# EAGLE design HID2AMI.Deluxe.Rev1.1.0.redist (EAGLE 9.2.0)
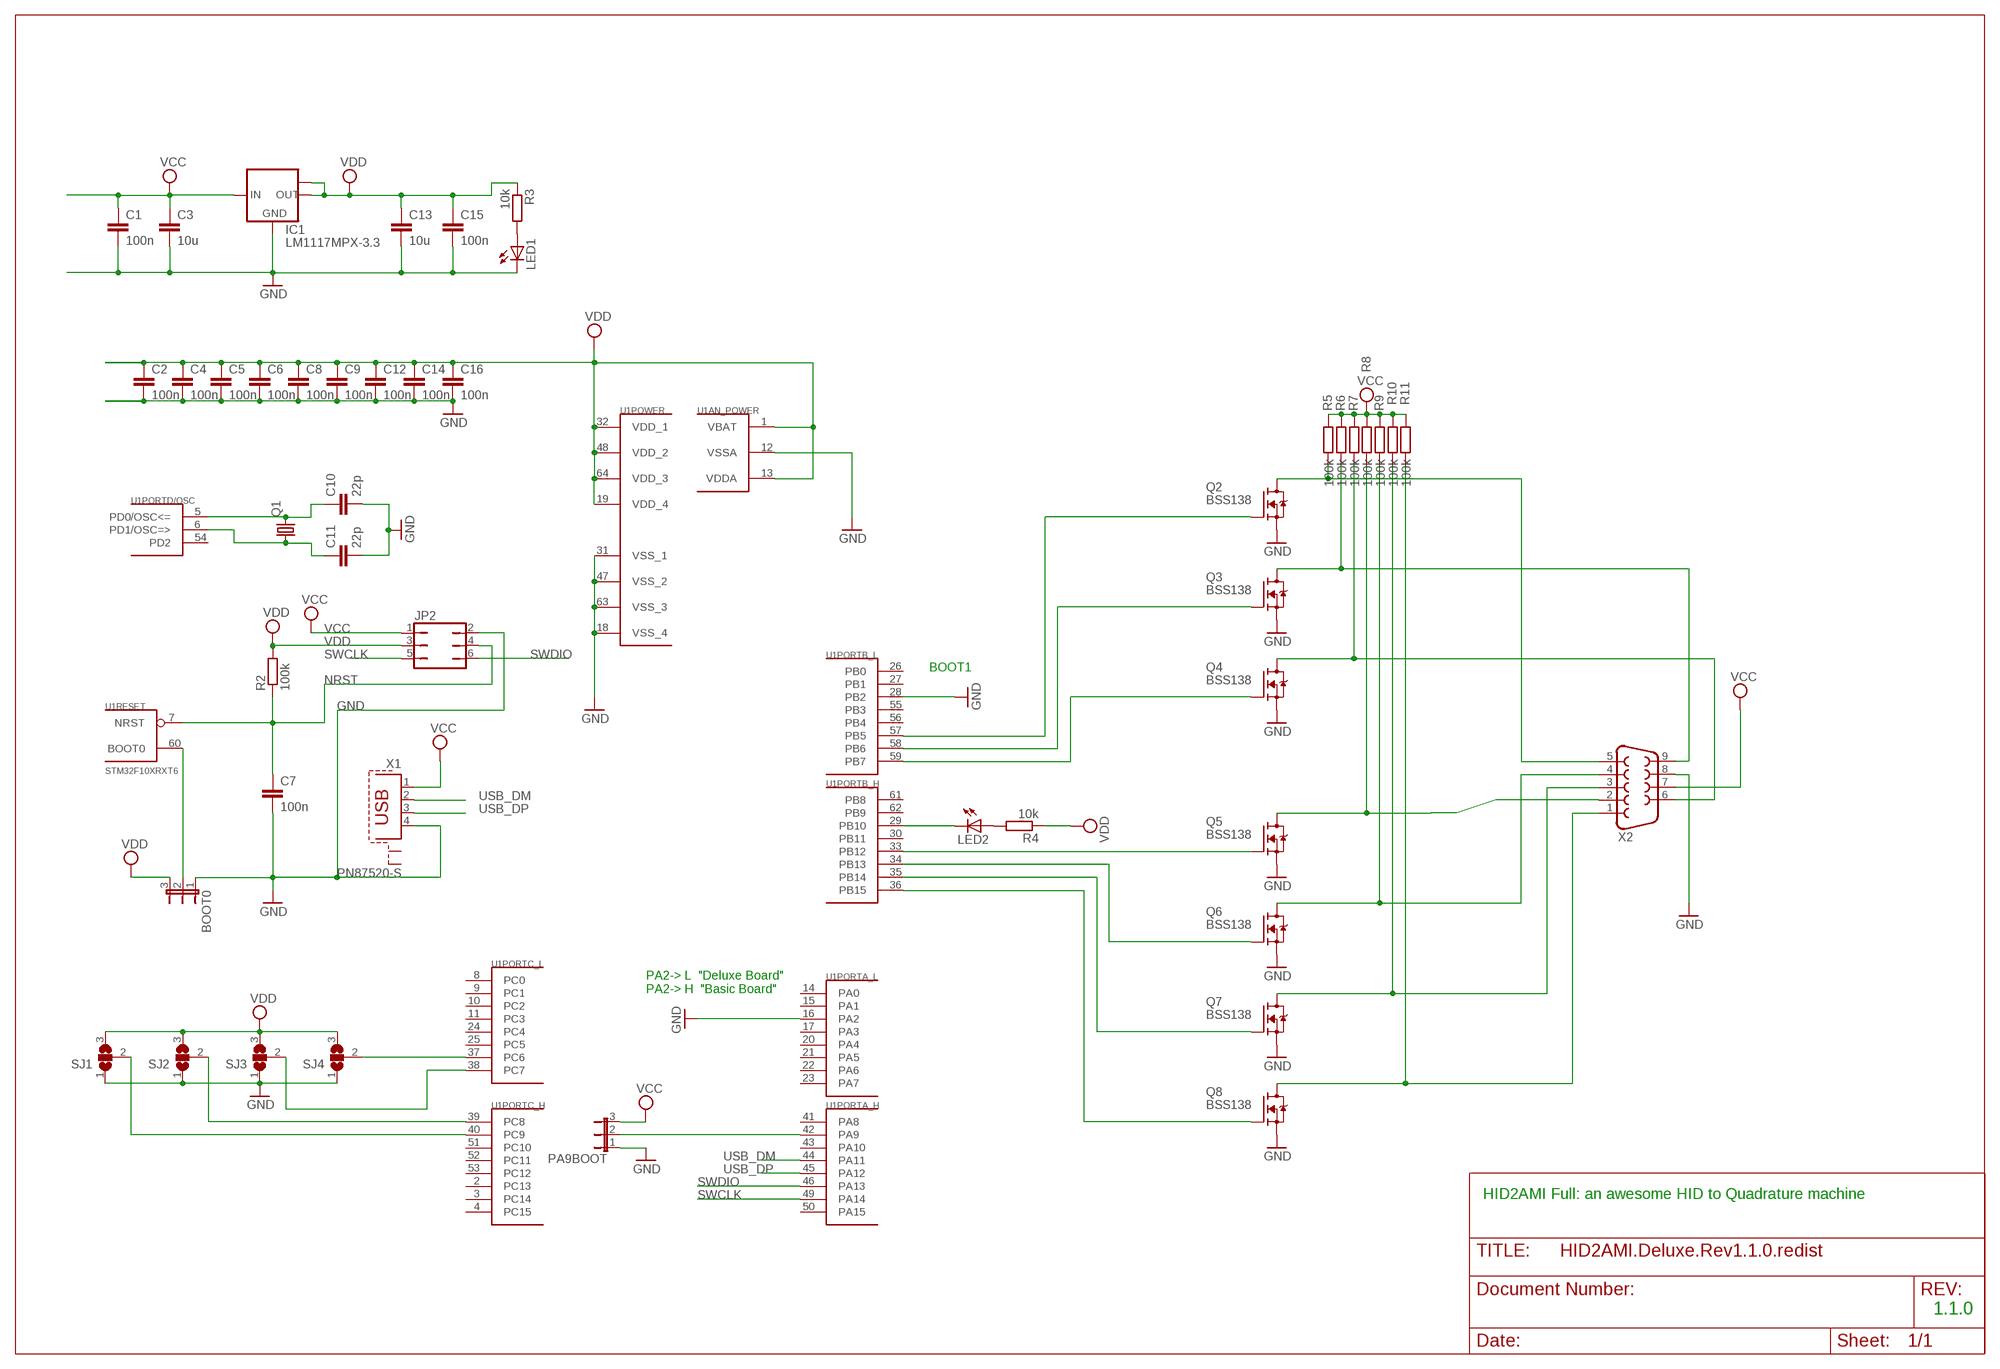
[diagram p0: schematic, sheet 1]

## Parts
BOOT0  JP2E  [JP2]
C1  100n  C-EUC0805  [C0805]
C2  100n  C-EUC0805  [C0805]
C3  10u  C-EUC1206  [C1206]
C4  100n  C-EUC0805  [C0805]
C5  100n  C-EUC0805  [C0805]
C6  100n  C-EUC0805  [C0805]
C7  100n  C-EUC0805  [C0805]
C8  100n  C-EUC0805  [C0805]
C9  100n  C-EUC0805  [C0805]
C10  22p  C-EUC0805  [C0805]
C11  22p  C-EUC0805  [C0805]
C12  100n  C-EUC0805  [C0805]
C13  10u  C-EUC0805  [C0805]
C14  100n  C-EUC0805  [C0805]
C15  100n  C-EUC0805  [C0805]
C16  100n  C-EUC0805  [C0805]
IC1  LM1117MPX-3.3  [SOT223]
JP2  JP3Q  [JP3Q]
LED1  LEDSML0805  [SML0805]
LED2  LEDSML0805  [SML0805]
PA9BOOT  JP2E  [JP2]
Q1  CRYSTALHC49S  [HC49/S]
Q2  BSS138  [SOT23]
Q3  BSS138  [SOT23]
Q4  BSS138  [SOT23]
Q5  BSS138  [SOT23]
Q6  BSS138  [SOT23]
Q7  BSS138  [SOT23]
Q8  BSS138  [SOT23]
R2  100k  R-EU_M0805  [M0805]
R3  10k  R-EU_M0805  [M0805]
R4  10k  R-EU_M0805  [M0805]
R5  100k  R-EU_M0805  [M0805]
R6  100k  R-EU_M0805  [M0805]
R7  100k  R-EU_M0805  [M0805]
R8  100k  R-EU_M0805  [M0805]
R9  100k  R-EU_M0805  [M0805]
R10  100k  R-EU_M0805  [M0805]
R11  100k  R-EU_M0805  [M0805]
SJ1  SJ2W  [SJ_2]
SJ2  SJ2W  [SJ_2]
SJ3  SJ2W  [SJ_2]
SJ4  SJ2W  [SJ_2]
U1  STM32F10XRXT6  [TQFP64]
X1  PN87520-S  [PN87520-S]
X2  F09HP  [F09HP]

## Nets
GND: BOOT0.1 C1.2 C2.2 C3.2 C4.2 C5.2 C6.2 C7.2 C8.2 C9.2 C10.2 C11.2 C12.2 C13.2 C14.2 C15.2 C16.2 IC1.1(GND) JP2.2 LED1.C PA9BOOT.1 Q2.2(S) Q3.2(S) Q4.2(S) Q5.2(S) Q6.2(S) Q7.2(S) Q8.2(S) SJ1.1 SJ2.1 SJ3.1 SJ4.1 U1.12(AN_POWER:VSSA) U1.16(PORTA_L:PA2) U1.18(POWER:VSS_4) U1.28(PORTB_L:PB2) U1.31(POWER:VSS_1) U1.47(POWER:VSS_2) U1.63(POWER:VSS_3) X1.4 X2.8
N$1: C10.1 Q1.2 U1.5(PORTD/OSC:PD0/OSC<=)
N$2: C11.1 Q1.1 U1.6(PORTD/OSC:PD1/OSC=>)
N$3: BOOT0.2 U1.60(RESET:BOOT0)
N$5: PA9BOOT.2 U1.42(PORTA_H:PA9)
N$6: SJ1.2 U1.40(PORTC_H:PC9)
N$7: LED2.A R4.2
N$8: LED2.C U1.29(PORTB_H:PB10)
N$9: SJ4.2 U1.37(PORTC_L:PC6)
N$10: SJ3.2 U1.38(PORTC_L:PC7)
N$11: SJ2.2 U1.39(PORTC_H:PC8)
N$12: LED1.A R3.2
N$13: Q2.1(G) U1.57(PORTB_L:PB5)
N$14: Q3.1(G) U1.58(PORTB_L:PB6)
N$15: Q4.1(G) U1.59(PORTB_L:PB7)
N$16: Q5.1(G) U1.33(PORTB_H:PB12)
N$17: Q6.1(G) U1.34(PORTB_H:PB13)
N$18: Q7.1(G) U1.35(PORTB_H:PB14)
N$19: Q8.1(G) U1.36(PORTB_H:PB15)
N$34: Q2.3(D) R5.2 X2.5
N$35: Q3.3(D) R6.2 X2.9
N$36: Q4.3(D) R7.2 X2.6
N$37: Q5.3(D) R8.2 X2.2
N$38: Q6.3(D) R9.2 X2.4
N$39: Q7.3(D) R10.2 X2.3
N$40: Q8.3(D) R11.2 X2.1
NRST: C7.1 JP2.4 R2.1 U1.7(RESET:NRST)
SWCLK: JP2.5 U1.49(PORTA_H:PA14)
SWDIO: JP2.6 U1.46(PORTA_H:PA13)
USB_DM: U1.44(PORTA_H:PA11) X1.2
USB_DP: U1.45(PORTA_H:PA12) X1.3
VCC: C1.1 C3.1 IC1.3(IN) JP2.1 PA9BOOT.3 R5.1 R6.1 R7.1 R8.1 R9.1 R10.1 R11.1 X1.1 X2.7
VDD: BOOT0.3 C2.1 C4.1 C5.1 C6.1 C8.1 C9.1 C12.1 C13.1 C14.1 C15.1 C16.1 IC1.2(OUT) IC1.TAB(OUT1) JP2.3 R2.2 R3.1 R4.1 SJ1.3 SJ2.3 SJ3.3 SJ4.3 U1.1(AN_POWER:VBAT) U1.13(AN_POWER:VDDA) U1.19(POWER:VDD_4) U1.32(POWER:VDD_1) U1.48(POWER:VDD_2) U1.64(POWER:VDD_3)
Unconnected: U1.2(PORTC_H:PC13) U1.3(PORTC_H:PC14) U1.4(PORTC_H:PC15) U1.8(PORTC_L:PC0) U1.9(PORTC_L:PC1) U1.10(PORTC_L:PC2) U1.11(PORTC_L:PC3) U1.14(PORTA_L:PA0) U1.15(PORTA_L:PA1) U1.17(PORTA_L:PA3) U1.20(PORTA_L:PA4) U1.21(PORTA_L:PA5) U1.22(PORTA_L:PA6) U1.23(PORTA_L:PA7) U1.24(PORTC_L:PC4) U1.25(PORTC_L:PC5) U1.26(PORTB_L:PB0) U1.27(PORTB_L:PB1) U1.30(PORTB_H:PB11) U1.41(PORTA_H:PA8) U1.43(PORTA_H:PA10) U1.50(PORTA_H:PA15) U1.51(PORTC_H:PC10) U1.52(PORTC_H:PC11) U1.53(PORTC_H:PC12) U1.54(PORTD/OSC:PD2) U1.55(PORTB_L:PB3) U1.56(PORTB_L:PB4) U1.61(PORTB_H:PB8) U1.62(PORTB_H:PB9) X1.S1 X1.S2

## Notes on the sheet
- BOOT1
- PA2-> L  "Deluxe Board"
  PA2-> H  "Basic Board"
- HID2AMI Full: an awesome HID to Quadrature machine
- 1.1.0

## Library data of the parts
BOOT0 PA9BOOT = jumper:JP2E: JUMPER
C1-C16 = rcl:C-EU: CAPACITOR, European symbol; SPICEPREFIX: C
IC1 = lm1117:LM1117MPX-*
JP2 = jumper:JP3Q: JUMPER
LED1 LED2 = led:LED: LED OSRAM: - CHIPLED LG R971, LG N971, LY N971, LG Q971, LY Q971, LO R971, LY R971 LH N974, LH R974 LS Q976, LO Q976, LY Q976 LO Q996 - Hyper CHIPLED LW Q18S LB Q993, LB Q99A, LB R99A - SideLED LS A670, LO A670, LY A670, LG A670, LP A670 LB A673, LV A673, LT A673, LW A673 LH A674 LY A675 LS A676, LA A676, LO A676, LY A676, LW A676 LS A679, LY A679, LG A679 - Hyper Micro SIDELED® LS Y876, LA Y876, LO Y876, LY Y876 LT Y87S - SmartLED LW L88C, LW L88S LB L89C, LB L89S, LG L890 LS L89K, LO L89K, LY L89K LS L896, LA L896, LO L896, LY L896 - TOPLED LS T670, LO T670, LY T670, LG T670, LP T670 LSG T670, LSP T670, LSY T670, LOP T670, LYG T670 LG T671, LOG T671, LSG T671 LB T673, LV T673, LT T673, LW T673 LH T674 LS T676, LA T676, LO T676, LY T676, LB T676, LH T676, LSB T676, LW T676 LB T67C, LV T67C, LT T67C, LS T67K, LO T67K, LY T67K, LW E67C LS E67B, LA E67B, LO E67B, LY E67B, LB E67C, LV E67C, LT E67C LW T67C LS T679, LY T679, LG T679 LS T770, LO T770, LY T770, LG T770, LP T770 LB T773, LV T773, LT T773, LW T773 LH T774 LS E675, LA E675, LY E675, LS T675 LS T776, LA T776, LO T776, LY T776, LB T776 LHGB T686 LT T68C, LB T68C - Hyper Mini TOPLED® LB M676 - Mini TOPLED Santana® LG M470 LS M47K, LO M47K, LY M47K Source: http://www.osram.convergy.de LUXEON: - LUMILED® LXK2-PW12-R00, LXK2-PW12-S00, LXK2-PW14-U00, LXK2-PW14-V00 LXK2-PM12-R00, LXK2-PM12-S00, LXK2-PM14-U00 LXK2-PE12-Q00, LXK2-PE12-R00, LXK2-PE12-S00, LXK2-PE14-T00, LXK2-PE14-U00 LXK2-PB12-K00, LXK2-PB12-L00, LXK2-PB12-M00, LXK2-PB14-N00, LXK2-PB14-P00, LXK2-PB14-Q00 LXK2-PR12-L00, LXK2-PR12-M00, LXK2-PR14-Q00, LXK2-PR14-R00 LXK2-PD12-Q00, LXK2-PD12-R00, LXK2-PD12-S00 LXK2-PH12-R00, LXK2-PH12-S00 LXK2-PL12-P00, LXK2-PL12-Q00, LXK2-PL12-R00 Source: www.luxeon.com KINGBRIGHT: KA-3528ASYC Source: www.kingbright.com
Q1 = crystal:CRYSTAL: CRYSTAL; OC_FARNELL: 1667008; OC_NEWARK: unknown
Q2-Q8 = bss138_10:BSS138: BSS138 N-Channel Logic Level Enhancement Mode Field Effect Transistor Source: http://www.fairchildsemi.com/datasheets/BS/BSS138.pdf; MF: Fairchild; MPN: BSS138; OC_FARNELL: 9845330; OC_NEWARK: 67R2009
R2-R11 = rcl:R-EU_: RESISTOR, European symbol; SPICEPREFIX: R
SJ1-SJ4 = jumper:SJ2W: SMD solder JUMPER
U1 = stm32:STM32F10XRXT6: STM32F101/103 64pin LQFP
X1 = con-berg:PN87520-S; OC_FARNELL: unknown; OC_NEWARK: unknown
X2 = con-subd:F09: SUB-D; OC_FARNELL: unknown; OC_NEWARK: unknown

## Board
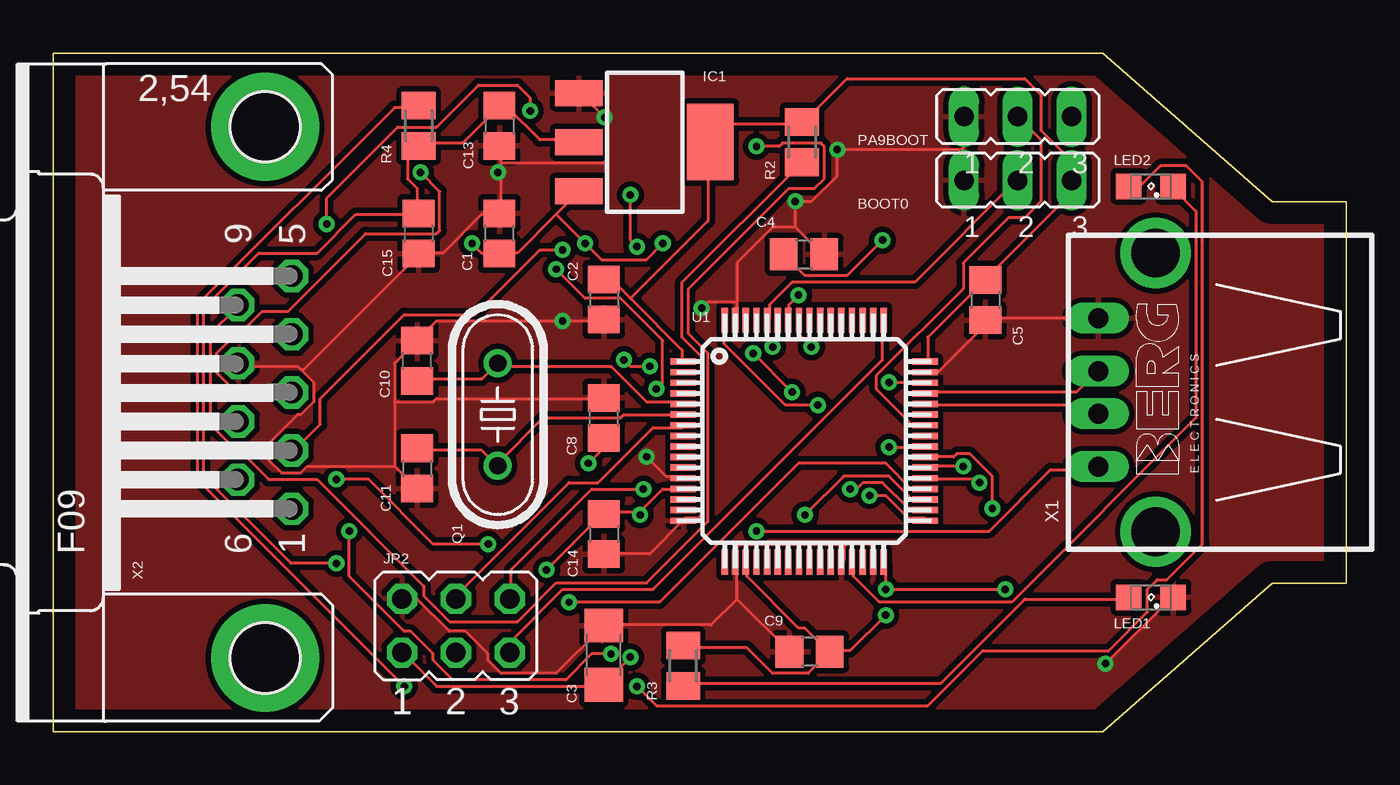
[diagram p1: board, top side]
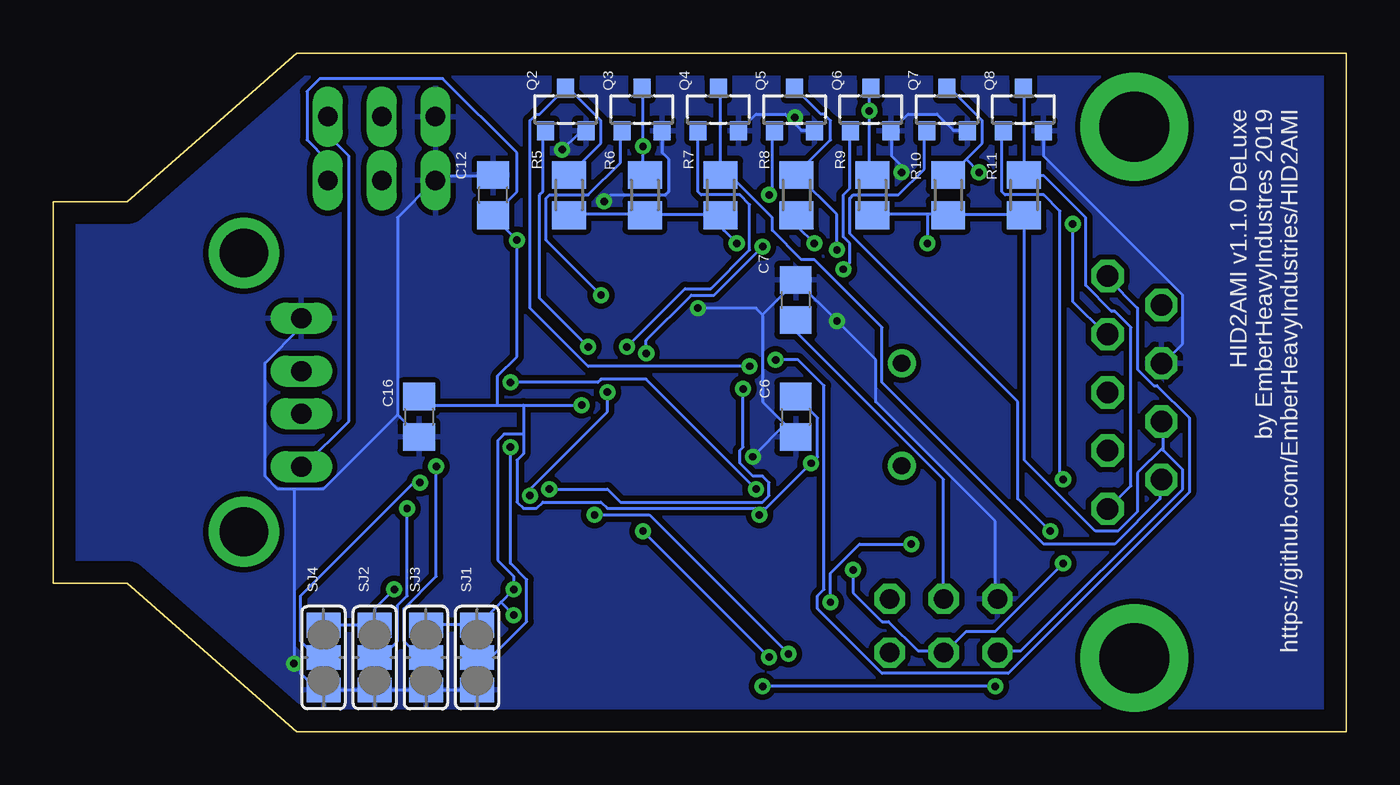
[diagram p2: board, bottom side, seen from below]

Size 61 x 32 mm. Coordinates in mm from the lower left corner, seen from the top.
Outline: 0,32 49.5,32 57.5,25 61,25 61,7 57.5,7 49.5,0 0,0 0,32
Copper layers (1*16): Top 0.035mm / dielectric 1.5mm / Bottom 0.035mm
Design rules "default": minimum track width 6mil, minimum drill 0.35mm, track to track 6mil, track to pad 6mil, pad to pad 6mil, via to via 6mil, smd to smd 6mil, copper to edge 40mil, drill to drill 6mil, minimum pad ring 10mil, minimum via ring 8mil, stop-mask expansion 4mil, vias tented up to drill 0mil, thermal gap 10mil

### Footprints (pad centres in the part's own frame; a part is rotated, then mirrored left to right if it is on the bottom)
JP2 = drill 0.914 long: 1 -2.54,0; 2 0,0; 3 2.54,0
C0805 = smd 1.3 x 1.5: 1 -0.95,0; 2 0.95,0
C1206 = smd 1.6 x 1.8: 1 -1.4,0; 2 1.4,0
SOT223 = smd 1.219 x 2.235: 1 -2.311,-3.099; 2 0,-3.099; 3 2.311,-3.099 | smd 3.6 x 2.2: TAB 0,3.099
JP3Q = drill 0.914 octagon: 1 -2.54,-1.27; 2 -2.54,1.27; 3 0,-1.27; 4 0,1.27; 5 2.54,-1.27; 6 2.54,1.27
SML0805 = smd 1.2 x 1.2: A 1.05,0; C -1.05,0
HC49/S = drill 0.813: 1 -2.413,0; 2 2.413,0
SOT23 = smd 0.8 x 0.9: 1 -0.95,-1; 2 0.95,-1; 3 0,1
M0805 = smd 1.3 x 1.6: 1 -0.95,0; 2 0.95,0
SJ_2 = smd 1.168 x 1.6: 1 -1.524,0; 2 0,0; 3 1.524,0
TQFP64 = smd 1.2 x 0.3: 1 -5.7,3.75; 2 -5.7,3.25; 3 -5.7,2.75; 4 -5.7,2.25; 5 -5.7,1.75; 6 -5.7,1.25; 7 -5.7,0.75; 8 -5.7,0.25; 9 -5.7,-0.25; 10 -5.7,-0.75; 11 -5.7,-1.25; 12 -5.7,-1.75; 13 -5.7,-2.25; 14 -5.7,-2.75; 15 -5.7,-3.25; 16 -5.7,-3.75; 33 5.7,-3.75; 34 5.7,-3.25; 35 5.7,-2.75; 36 5.7,-2.25; 37 5.7,-1.75; 38 5.7,-1.25; 39 5.7,-0.75; 40 5.7,-0.25; 41 5.7,0.25; 42 5.7,0.75; 43 5.7,1.25; 44 5.7,1.75; 45 5.7,2.25; 46 5.7,2.75; 47 5.7,3.25; 48 5.7,3.75 | smd 0.3 x 1.2: 17 -3.75,-5.7; 18 -3.25,-5.7; 19 -2.75,-5.7; 20 -2.25,-5.7; 21 -1.75,-5.7; 22 -1.25,-5.7; 23 -0.75,-5.7; 24 -0.25,-5.7; 25 0.25,-5.7; 26 0.75,-5.7; 27 1.25,-5.7; 28 1.75,-5.7; 29 2.25,-5.7; 30 2.75,-5.7; 31 3.25,-5.7; 32 3.75,-5.7; 49 3.75,5.7; 50 3.25,5.7; 51 2.75,5.7; 52 2.25,5.7; 53 1.75,5.7; 54 1.25,5.7; 55 0.75,5.7; 56 0.25,5.7; 57 -0.25,5.7; 58 -0.75,5.7; 59 -1.25,5.7; 60 -1.75,5.7; 61 -2.25,5.7; 62 -2.75,5.7; 63 -3.25,5.7; 64 -3.75,5.7
PN87520-S = drill 0.95 long: 1 -3.5,2.71; 2 -1,2.71; 3 1,2.71; 4 3.5,2.71 | drill 2.3 pad 2.9: S1 -6.57,0; S2 6.57,0
F09HP = drill 1.016 octagon: 1 -5.486,-1.27; 2 -2.743,-1.27; 3 0,-1.27; 4 2.743,-1.27; 5 5.486,-1.27; 6 -4.115,1.27; 7 -1.372,1.27; 8 1.372,1.27; 9 4.115,1.27 | drill 3.302 pad 5.08: G1 -12.522,0; G2 12.522,0

### Placement (x,y rotation side)
BOOT0  45.5,26 0 top
C1  21.05,23.49 90 top
C2  25.98,20.38 270 top
C3  25.98,3.61 90 top
C4  35.42,22.52 0 top
C5  43.97,20.36 270 top
C6  25.97,14.86 270 bottom
C7  25.97,20.36 90 bottom
C8  25.98,14.8 90 top
C9  35.68,3.77 180 top
C10  17.16,17.5 90 top
C11  17.16,12.42 270 top
C12  40.24,25.3 90 bottom
C13  21.05,28.57 270 top
C14  25.98,9.33 270 top
C15  17.24,23.49 270 top
C16  43.74,14.86 270 bottom
IC1  27.9,27.8 270 top
JP2  19,5 0 top
LED1  51.77,6.34 180 top
LED2  51.77,25.71 180 top
PA9BOOT  45.5,29 0 top
Q1  20.97,14.96 90 top
Q2  36.82,29.34 0 bottom
Q3  33.22,29.34 0 bottom
Q4  29.63,29.34 0 bottom
Q5  26.03,29.34 0 bottom
Q6  22.43,29.34 0 bottom
Q7  18.84,29.34 0 bottom
Q8  15.24,29.34 0 bottom
R2  35.33,27.8 90 top
R3  29.72,3.11 270 top
R4  17.24,28.57 90 top
R5  36.66,25.3 90 bottom
R6  33.09,25.3 90 bottom
R7  29.51,25.3 90 bottom
R8  25.94,25.3 90 bottom
R9  22.36,25.3 90 bottom
R10  18.79,25.3 90 bottom
R11  15.21,25.3 90 bottom
SJ1  41,3.5 90 bottom
SJ2  45.83,3.5 90 bottom
SJ3  43.41,3.5 90 bottom
SJ4  48.24,3.5 90 bottom
U1  35.43,13.7 0 top
X1  52,16 90 top
X2  10,16 90 top

### Tracks (layer width: path | path; a pad name or v marks a point on that pad's centre or on a via)
GND  (via drill 0.35)
  Top 0.152: v49.63,3.21 52.68,6.26 LED1.C | U1.47 41.25,16.93 41.71,16.93 43.84,19.06 43.84,19.37 C5.2 44,19.52 49.18,19.52 X1.4 | 35,23.79 v35,25.01 35.77,25.01 36.98,26.23 v36.98,27.44 42.93,27.44 | 35,23.79 36.22,22.57 C4.2 | 32.26,20.28 32.26,22.11 33.94,23.79 35,23.79 | 32.26,20.28 32.26,19.52 U1.63 | 42.93,27.44 42.93,26.07 BOOT0.1 | 42.93,27.44 42.93,28.97 PA9BOOT.1 | IC1.1 24.95,30.03 v26.01,28.97 26.01,28.66 26.16,28.51 26.16,26.99 26.01,26.84 21.14,26.84 | 21.14,26.38 21.14,24.55 C1.2 20.98,24.4 20.22,24.4 18.39,22.57 17.33,22.57 C15.2 17.17,22.41 11.84,17.08 11.69,17.08 | 21.14,26.38 21.14,26.84 | 21.14,26.84 21.14,27.6 C13.2 | 21.14,26.38 v20.98,26.38 | 16.11,12.51 17.02,11.59 C11.2 | 16.11,15.56 16.11,17.39 17.02,18.3 C10.2 17.17,18.45 18.09,19.37 v24.03,19.37 25.86,19.37 C2.2 | 16.11,15.56 16.11,12.51 | 16.11,15.56 17.94,15.56 18.09,15.71 25.86,15.71 C8.2 | 16.11,12.51 11.99,12.51 11.69,12.2 10.77,12.2 10.16,12.81 10.16,13.58 11.53,14.95 11.69,14.95 12.3,15.56 12.3,16.47 11.69,17.08 | 11.69,17.08 11.53,17.23 8.79,17.23 X2.8 | C14.2 26.01,8.39 28.15,8.39 29.67,9.92 U1.16 29.82,10.07 30.43,10.07 30.58,10.22 30.58,11.75 30.43,11.9 29.82,11.9 U1.12 29.67,12.05 28.91,12.05 v27.99,12.97 | 37.29,8.7 37.29,8.09 U1.28 | 37.29,8.7 37.44,8.85 38.51,8.85 38.66,8.7 38.66,8.09 U1.31 | 32.26,6.26 32.26,7.94 U1.18 32.26,8.09 32.26,8.7 32.41,8.85 36.98,8.85 37.14,8.7 37.29,8.7 | 32.26,6.26 34.7,3.82 C9.2 | 32.26,6.26 31.04,5.04 26.01,5.04 C3.2 25.86,4.89 23.73,2.76 21.14,2.76 20.53,3.36 20.53,3.67 19.46,4.74 18.7,4.74 17.17,6.26 16.56,6.26 JP2.2 | 32.26,20.28 30.89,20.28 v30.58,19.98
  Bottom 0.152: SJ1.1 41.1,1.99 43.39,1.99 SJ3.1 43.54,1.99 45.82,1.99 SJ2.1 45.98,1.99 48.11,1.99 SJ4.1 48.26,1.99 48.57,1.99 49.33,2.76 49.33,2.91 v49.63,3.21 49.63,11.44 | v35,25.01 34.7,25.31 32.11,25.31 31.96,25.46 31.96,26.99 32.26,27.29 32.26,28.21 Q3.2 | v36.98,27.44 36.22,28.21 35.92,28.21 Q2.2 | 44.76,14.95 43.84,14.03 C16.2 | 44.76,14.95 44.76,24.24 43.08,25.92 BOOT0.1 42.93,26.07 42.78,26.23 40.34,26.23 C12.2 | 49.63,11.44 48.26,11.44 44.76,14.95 | 49.63,11.44 50.4,11.44 51.01,12.05 51.01,17.39 49.33,19.06 49.33,19.37 X1.4 | 26.16,28.82 26.47,29.12 27.84,29.12 28.6,28.36 Q4.2 | 26.16,28.82 25.71,28.36 25.1,28.36 Q5.2 | v26.01,28.97 26.16,28.82 | Q7.2 17.94,28.36 18.55,28.36 19.31,29.12 20.68,29.12 21.44,28.36 Q6.2 21.44,28.21 21.44,27.14 20.98,26.68 v20.98,26.38 | Q8.2 14.28,28.21 14.28,27.14 7.72,20.59 7.72,18.3 8.64,17.39 X2.8 | 26.47,14.49 27.54,15.56 27.54,19.67 | 26.47,14.49 26.01,14.03 C6.2 26.47,14.49 | 27.54,19.67 26.01,21.2 C7.2 25.86,21.2 v24.03,19.37 22.2,17.54 22.2,15.56 16.56,9.92 16.56,6.41 JP2.2 | 26.47,14.49 v27.99,12.97 | v30.58,19.98 27.84,19.98 27.54,19.67
  pour Bottom (isolate 0.254): 0,32 49.5,32 57.5,25 61,25 61,7 57.5,7 49.5,0 0,0
  pour Top (isolate 0.254): 0,32 49.5,32 57.5,25 61,25 61,7 57.5,7 49.5,0 0,0
N$1
  Top 0.152: U1.5 29.67,15.56 27.99,15.56 26.32,17.23 20.98,17.23 Q1.2 20.83,17.23 20.22,16.62 17.17,16.62 C10.1
N$2
  Top 0.152: U1.6 29.67,14.95 26.93,14.95 26.77,14.8 23.12,14.8 20.98,12.66 Q1.1 20.83,12.66 20.22,13.27 17.17,13.27 C11.1
N$3
  Top 0.152: U1.60 33.78,19.52 33.78,20.13 34.85,21.2 40.64,21.2 45.37,25.92 BOOT0.2
N$5
  Top 0.152: U1.42 41.1,14.49 40.49,14.49 38.81,16.17 38.81,16.78 42.93,20.89 42.93,22.11 45.06,24.24 45.82,24.24 46.59,25.01 46.59,27.9 45.52,28.97 PA9BOOT.2
N$6  (via drill 0.35)
  Top 0.152: v39.42,13.42 41.1,13.42 U1.40
  Bottom 0.152: v39.42,13.42 39.42,7.94 38.66,7.18 38.66,5.19 40.34,3.52 40.95,3.52 SJ1.2
N$7  (via drill 0.35)
  Top 0.152: v27.54,2.15 28.45,1.23 41.25,1.23 43.84,3.82 49.79,3.82 51.62,5.65 51.62,6.72 52.07,7.18 52.53,7.18 54.21,8.85 54.21,25.92 53.44,26.68 52.23,26.68 51.31,25.77 50.85,25.77 LED2.A | v16.56,2.15 6.81,11.9 6.81,20.13 16.11,29.43 17.17,29.43 R4.2
  Bottom 0.152: v16.56,2.15 v27.54,2.15
N$8
  Top 0.152: U1.29 37.75,7.94 37.75,7.33 38.97,6.11 45.22,6.11 53.9,14.8 53.9,24.55 52.84,25.62 LED2.C
N$9  (via drill 0.35)
  Top 0.152: v43.69,11.75 43.54,11.9 41.25,11.9 U1.37
  Bottom 0.152: v43.69,11.75 44,11.75 49.33,6.41 49.33,4.28 48.57,3.52 48.26,3.52 SJ4.2
N$10  (via drill 0.35)
  Top 0.152: v42.93,12.51 41.25,12.51 U1.38
  Bottom 0.152: v42.93,12.51 42.93,7.33 44.45,5.8 44.45,4.28 43.54,3.36 SJ3.2
N$11  (via drill 0.35)
  Top 0.152: v44.3,10.53 44.3,12.05 43.23,13.12 42.62,13.12 42.47,12.97 41.25,12.97 U1.39
  Bottom 0.152: v44.3,10.53 44.3,6.41 44.76,5.96 44.76,4.28 45.52,3.52 45.82,3.52 SJ2.2
N$12
  Top 0.152: LED1.A 50.7,6.26 45.82,6.26 41.86,2.3 29.82,2.3 R3.2
N$13  (via drill 0.35)
  Top 0.152: v35.77,18.15 35.16,18.76 35.16,19.37 U1.57
  Bottom 0.152: v35.77,18.15 38.05,20.43 38.05,25.31 37.9,25.46 37.9,28.21 Q2.1
N$14  (via drill 0.35)
  Top 0.152: v35.16,20.59 34.7,20.13 34.7,19.52 U1.58
  Bottom 0.152: v35.16,20.59 37.75,23.18 37.75,25.16 37.59,25.31 35.77,25.31 34.24,26.84 34.24,28.21 Q3.1
N$15  (via drill 0.35)
  Top 0.152: v33.94,18.15 33.94,18.45 34.09,18.6 34.09,19.37 U1.59
  Bottom 0.152: v33.94,18.15 31.19,20.89 29.98,20.89 28.15,22.72 28.15,24.85 28.6,25.31 30.43,25.31 30.58,25.46 30.58,28.21 Q4.1
N$16  (via drill 0.35)
  Top 0.152: v27.23,25.31 27.23,23.18 v27.54,22.87 | v34.85,16.01 v33.02,17.84 | v38.51,11.14 39.27,11.14 40.34,10.07 41.1,10.07 U1.33
  Bottom 0.152: v27.23,25.31 27.08,25.46 27.08,28.21 Q5.1 | v27.54,22.87 29.82,20.59 30.89,20.59 33.02,18.45 v33.02,17.84 | v34.85,16.01 34.85,15.1 38.51,11.44 v38.51,11.14
N$17  (via drill 0.35)
  Top 0.152: v23.73,21.81 25.1,20.43 26.77,20.43 28.76,18.45 28.76,16.47 v28.45,16.17 | v37.59,11.44 37.9,11.44 38.2,11.75 39.12,11.75 40.34,10.53 41.1,10.53 U1.34
  Bottom 0.152: v23.73,21.81 23.42,22.11 23.42,23.02 23.73,23.33 23.73,25.31 23.42,25.62 23.42,28.21 Q6.1 | v28.45,16.17 28.45,13.42 28.6,13.27 28.6,12.66 27.99,12.05 27.54,12.05 27.23,11.75 27.23,11.14 27.54,10.83 34.24,10.83 34.85,11.44 v37.59,11.44
N$18  (via drill 0.35)
  Top 0.152: v13.97,9.46 13.97,7.33 16.56,4.74 16.87,4.74 17.94,3.67 17.94,3.36 18.85,2.45 24.18,2.45 25.4,3.67 v26.32,3.67 | v35.46,10.22 37.29,12.05 39.42,12.05 40.49,10.98 41.1,10.98 U1.35
  Bottom 0.152: v13.97,9.46 15.5,10.98 15.5,15.56 23.42,23.48 23.42,25.16 23.27,25.31 21.14,25.31 19.92,26.53 19.92,28.21 Q7.1 | v26.32,3.67 32.87,10.22 v35.46,10.22
N$19  (via drill 0.35)
  Top 0.152: v13.36,11.9 14.89,11.9 17.94,8.85 v20.53,8.85 | v24.34,6.11 28.6,6.11 35.16,12.66 39.27,12.66 40.49,11.44 41.1,11.44 U1.36
  Bottom 0.152: v13.36,11.9 13.52,12.05 13.52,24.55 14.28,25.31 16.11,25.31 16.26,25.46 16.26,28.21 Q8.1 | v20.53,8.85 22.96,8.85 24.34,7.48 v24.34,6.11
N$34  (via drill 0.35)
  Top 0.152: v28.15,17.23 27.23,17.23 v26.93,17.54
  Bottom 0.152: R5.2 36.53,26.38 35.16,27.75 35.16,28.82 36.68,30.34 Q2.3 36.83,30.34 38.05,29.12 38.2,29.12 38.51,28.82 38.51,19.98 35.77,17.23 v28.15,17.23 | v26.93,17.54 25.86,17.54 24.64,16.32 24.64,6.72 24.95,6.41 24.95,5.8 21.9,2.76 15.95,2.76 7.42,11.29 7.42,14.8 8.94,16.32 9.1,16.32 9.86,17.08 9.86,19.98 11.23,21.35 X2.5
N$35  (via drill 0.35)
  Top 0.152: v33.17,27.6 34.24,27.6 34.39,27.75 36.22,27.75 36.38,27.6 36.38,26.07 35.92,25.62 34.7,25.62 29.98,20.89 29.98,18.76 30.89,17.84 30.89,9.92 27.99,7.02 23.73,7.02 21.9,5.19 18.7,5.19 17.48,6.41 17.48,6.87 12.45,11.9 10.16,11.9 8.49,13.58 8.33,13.58 7.42,14.49 7.42,18.76 8.64,19.98 X2.9
  Bottom 0.152: Q3.3 33.17,30.34 v33.17,27.6 33.17,26.38 R6.2
N$36
  Bottom 0.152: Q4.3 29.52,30.34 29.52,26.38 R7.2 29.36,26.23 29.06,26.23 27.08,24.24 27.08,23.63 25.71,22.26 25.1,22.26 21.9,19.06 21.9,16.47 14.28,8.85 10.93,8.85 8.79,10.98 8.79,11.75 X2.6
N$37  (via drill 0.35)
  Top 0.152: v24.03,22.72 22.96,22.72 19.92,19.67 16.56,19.67 12.6,15.71 12.6,14.49 11.38,13.27 X2.2
  Bottom 0.152: Q5.3 26.01,30.34 24.79,29.12 24.64,29.12 24.34,28.82 24.34,27.9 25.86,26.38 R8.2 25.86,26.23 24.03,24.4 v24.03,22.72
N$38  (via drill 0.35)
  Top 0.152: v22.51,29.27 22.51,29.88 21.9,30.49 20.07,30.49 18.09,28.51 16.26,28.51 12.91,25.16 v12.91,23.94
  Bottom 0.152: Q6.3 22.51,30.34 v22.51,29.27 22.51,26.38 R9.2 | v12.91,23.94 12.91,20.28 11.38,18.76 X2.4
N$39  (via drill 0.35)
  Top 0.152: v17.33,26.38 18.24,25.46 18.24,23.63 18.09,23.48 14.73,23.48 11.08,19.82 9.86,19.82 8.49,18.45 8.33,18.45 7.72,17.84 7.72,16.93 8.64,16.01 11.23,16.01 X2.3
  Bottom 0.152: 17.94,26.99 18.7,26.23 R10.2 | 17.94,26.99 17.17,27.75 17.17,28.82 18.7,30.34 Q7.3 | v17.33,26.38 17.94,26.99
N$40
  Bottom 0.152: Q8.3 15.19,30.34 15.19,26.38 R11.2 15.19,26.23 14.28,26.23 12.3,24.24 12.3,21.04 11.08,19.82 10.93,19.82 10.16,19.06 10.16,11.59 11.23,10.53 X2.1
NRST
  Top 0.152: JP2.4 19,6.41 24.34,11.75 25.71,11.75 28.3,14.34 29.67,14.34 U1.7 29.82,14.49 30.43,14.49 30.58,14.64 30.58,17.69 29.67,18.6 29.67,21.2 35.31,26.84 R2.1
  Bottom 0.152: C7.1 25.86,19.37 25.86,18.76 19,11.9 19,6.41 JP2.4
SWCLK
  Top 0.152: U1.49 39.12,19.37 39.12,17.54 28.3,6.72 24.03,6.72 21.59,4.28 21.59,3.82 JP2.5
SWDIO  (via drill 0.35)
  Top 0.152: v39.42,16.47 41.1,16.47 U1.46 | v27.84,11.44 25.4,11.44 21.59,7.63 21.59,6.41 JP2.6
  Bottom 0.152: v39.42,16.47 35.31,16.47 35.16,16.62 33.02,16.62 v27.84,11.44
USB_DM
  Top 0.152: U1.44 41.25,15.41 48.87,15.41 49.18,15.1 X1.2
USB_DP
  Top 0.152: U1.45 41.25,16.01 48.26,16.01 49.18,16.93 X1.3
VCC  (via drill 0.35)
  Top 0.152: 23.73,24.4 24.79,25.46 IC1.3 | 23.73,24.4 21.9,22.57 21.14,22.57 C1.1 20.98,22.57 20.22,22.57 v19.76,23.02 | 23.73,24.4 v25.1,23.02 25.86,22.26 27.99,22.26 v28.76,23.02 | JP2.1 16.56,3.67 18.09,2.15 25.86,2.15 C3.1 26.01,2.3 v27.23,3.52 | v33.17,9.46 44.15,9.46 47.04,12.36 49.18,12.36 X1.1
  Bottom 0.152: PA9BOOT.3 47.96,28.97 47.96,28.05 47.04,27.14 47.04,14.64 49.18,12.51 X1.1 | R5.1 36.53,24.4 33.17,24.4 R6.1 33.02,24.4 29.52,24.4 R7.1 29.36,24.24 29.36,23.63 v28.76,23.02 | v25.1,23.02 25.86,23.79 25.86,24.24 R8.1 | 19.76,24.4 18.85,24.4 R10.1 18.7,24.4 15.34,24.4 R11.1 15.19,24.24 15.19,12.81 11.84,9.46 10.77,9.46 9.86,10.38 9.86,12.2 8.64,13.42 | 19.76,24.4 22.36,24.4 R9.1 | 8.64,13.42 8.64,13.27 7.72,12.36 7.72,11.44 15.34,3.82 16.41,3.82 JP2.1 | 8.64,13.42 8.64,14.49 X2.7 | 19.76,24.4 v19.76,23.02 | v27.23,3.52 v33.17,9.46
VDD  (via drill 0.35)
  Top 0.152: IC1.2 24.79,27.9 22.96,27.9 21.44,29.43 21.14,29.43 C13.1 20.98,29.43 19.31,27.75 17.33,27.75 R4.1 17.17,27.6 16.72,27.14 16.72,26.07 17.17,25.62 17.17,24.55 C15.1 17.17,24.4 14.28,24.4 12.45,22.57 9.71,22.57 7.12,19.98 7.12,12.05 11.23,7.94 v13.36,7.94 | 27.69,10.38 28.76,11.44 29.67,11.44 U1.13 | 27.69,10.38 26.01,10.38 C14.1 25.86,10.22 v23.27,7.63 | U1.48 41.25,17.54 41.25,18.6 43.84,21.2 C5.1 44,21.35 47.96,25.31 47.96,25.92 BOOT0.3 47.96,26.07 47.96,26.99 46.59,28.36 46.59,30.03 45.82,30.8 37.44,30.8 35.46,28.82 R2.2 35.31,28.66 31.8,28.66 31.04,27.9 IC1.TAB 30.89,27.75 30.89,24.09 27.23,20.43 | 27.23,20.43 26.47,21.2 26.01,21.2 C2.1 | 27.23,20.43 29.67,18 29.67,17.54 U1.1 | U1.19 32.72,7.94 32.72,7.33 35.16,4.89 35.46,4.89 36.53,3.82 C9.1 | R3.1 29.82,3.98 32.72,3.98 33.94,2.76 35.61,2.76 36.53,3.67 C9.1 | U1.32 39.27,7.94 v39.27,6.72 v44.91,6.72 | v39.27,5.5 37.59,3.82 36.68,3.82 C9.1 | v39.12,23.18 37.44,21.5 35.46,21.5 34.55,22.41 C4.1 | v36.07,15.41 34.55,15.41 31.65,18.3 31.65,19.37 U1.64 | v25.25,12.66 25.86,13.27 25.86,13.73 C8.1 | v27.69,10.22 27.69,10.38
  Bottom 0.152: v23.27,7.63 23.27,6.57 21.9,5.19 21.59,5.19 20.22,3.82 19,3.82 JP2.3 18.85,3.82 17.94,4.74 16.56,4.74 v13.36,7.94 | SJ4.3 48.11,5.04 45.98,5.04 SJ2.3 45.82,5.04 45.82,5.8 v44.91,6.72 | 39.88,6.11 40.95,5.04 SJ1.3 41.1,5.04 43.39,5.04 SJ3.3 | 39.88,6.11 v39.27,6.72 39.27,7.33 40.03,8.09 40.03,13.73 39.73,14.03 38.81,14.03 | 39.88,6.11 v39.27,5.5 | 40.03,15.41 43.39,15.41 43.69,15.71 C16.1 | 40.03,15.41 38.81,15.41 | 38.81,15.41 v36.07,15.41 | 27.69,10.53 34.85,10.53 35.16,10.83 37.9,10.83 38.2,10.53 38.81,10.53 39.12,10.83 39.12,12.81 38.81,13.12 38.81,14.03 | 27.69,10.53 27.38,10.53 v25.25,12.66 24.95,12.97 24.95,14.8 25.86,15.71 C6.1 | 38.81,15.41 38.81,14.03 | 40.03,15.41 40.03,16.78 39.12,17.69 v39.12,23.18 40.19,24.24 C12.1 40.19,24.4 39.12,25.46 39.12,27.29 42.62,30.8 48.41,30.8 49.02,30.19 49.02,27.9 48.11,26.99 48.11,26.07 BOOT0.3 | 27.69,10.53 v27.69,10.22

### Text on the board
bPlace: HID2AMI v1.1.0 DeLuxe / by EmberHeavyIndustres 2019 / https://github.com/EmberHeavyIndustries/HID2AMI